# Altium schematic sheet 07-TCXO_Crystal.SchDoc
size B; SheetNumber: 7; SheetTotal: 12
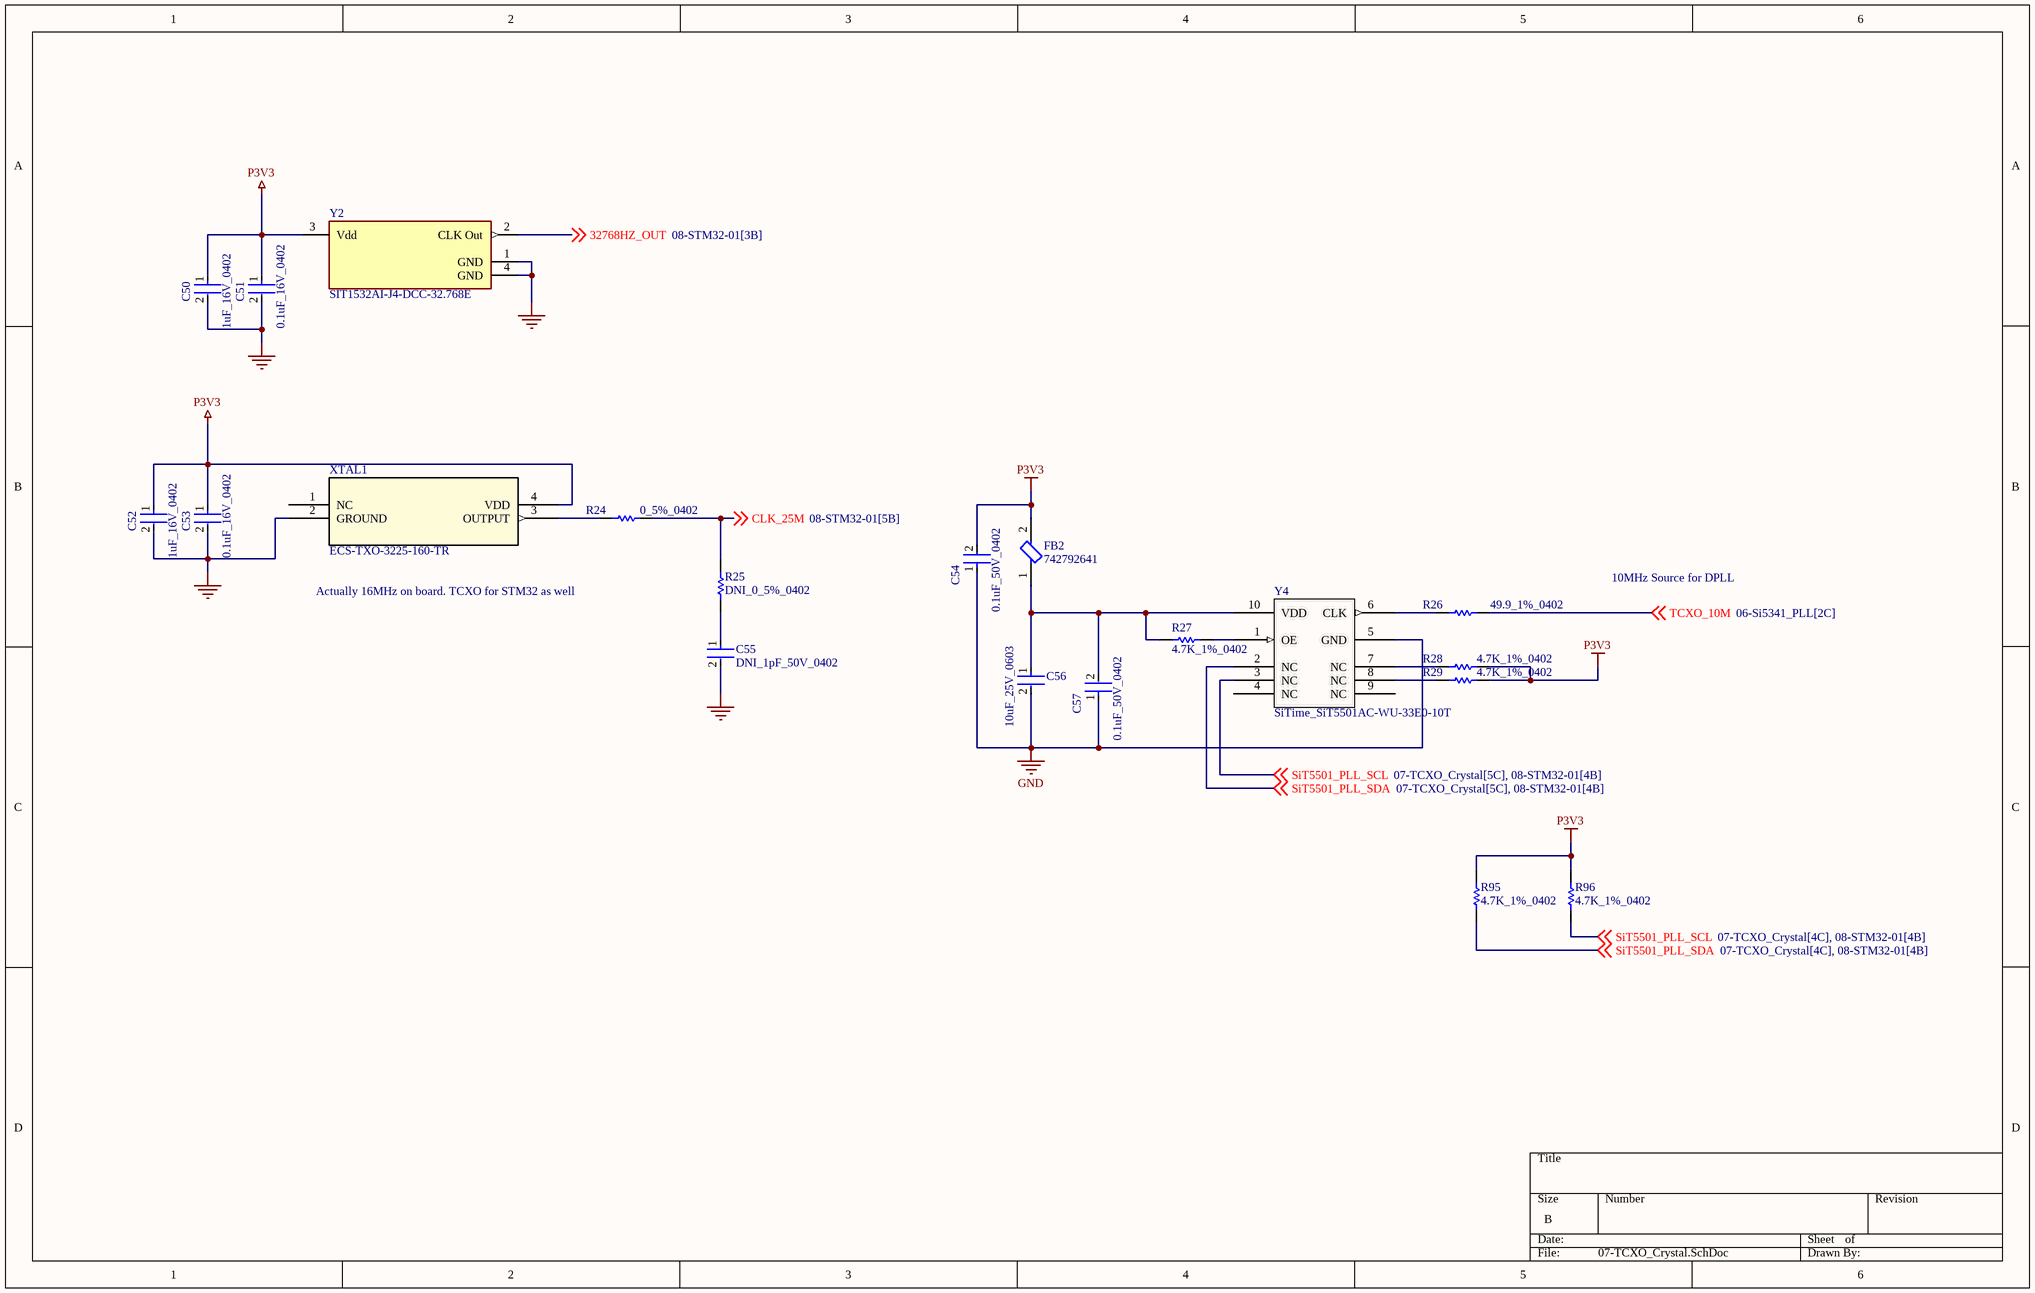
[diagram p0: 07-TCXO_Crystal.SchDoc]

## Parts
C50  1uF_16V_0402  [FP-0402-L_1_0_0_05-W_0_5-IPC_A]
C51  0.1uF_16V_0402  [FP-C0402-BB-MFG]
C52  1uF_16V_0402  [FP-0402-L_1_0_0_05-W_0_5-IPC_A]
C53  0.1uF_16V_0402  [FP-C0402-BB-MFG]
C54  0.1uF_50V_0402  [FP-C1005-050-0_05-IPC_C]
C55  DNI_1pF_50V_0402  [FP-GJM155-0_05-IPC_B]  (no BOM)
C56  10uF_25V_0603  [FP-CL10-IPC_C]
C57  0.1uF_50V_0402  [FP-C1005-050-0_05-IPC_C]
FB2  742792641  [FP-742792641-MFG]
R24  0_5%_0402  [RESC1005X40X25NL05T10]
R25  DNI_0_5%_0402  [RESC1005X40X25NL05T10]  (no BOM)
R26  49.9_1%_0402  [RESC1005X40X25NL10T10]
R27  4.7K_1%_0402  [RESC1005X40X25NL10T10]
R28  4.7K_1%_0402  [RESC1005X40X25NL10T10]
R29  4.7K_1%_0402  [RESC1005X40X25NL10T10]
R95  4.7K_1%_0402  [RESC1005X40X25NL10T10]
R96  4.7K_1%_0402  [RESC1005X40X25NL10T10]
XTAL1  ECS-TXO-3225-160-TR  [ECS-TXO-3225_ECS]
Y2  SIT1532AI-J4-DCC-32.768E  [FP-SIT1532-MFG]
Y4  SiTime_SiT5501AC-WU-33E0-10T  [SITIME_SPL-086-CQFN-010-C07050_REV_DRAFT]

## Nets
GND: C50.2 C51.2 C52.2 C53.2 C54.1 C55.2 C56.2 C57.1 XTAL1.2(GROUND) Y2.1(GND) Y2.4(GND) Y4.5(GND)
P3V3: C50.1 C51.1 C52.1 C53.1 C54.2 FB2.2 R28.2 R29.2 R95.2 R96.2 XTAL1.4(VDD) Y2.3(Vdd)
32768HZ_OUT: Y2.2(CLK_Out) ; off-sheet 32768HZ_OUT
CLK_25M: R24.2 R25.2 ; off-sheet CLK_25M
SiT5501_PLL_SCL: R96.1 Y4.3(NC) ; off-sheet SiT5501_PLL_SCL
SiT5501_PLL_SDA: R95.1 Y4.2(NC) ; off-sheet SiT5501_PLL_SDA
TCXO_10M: R26.1 ; off-sheet TCXO_10M
NetC55_1: C55.1 R25.1
NetC56_1: C56.1 C57.2 FB2.1 R27.1 Y4.10(VDD)
NetR24_1: R24.1 XTAL1.3(OUTPUT)
NetR26_2: R26.2 Y4.6(CLK)
NetR27_2: R27.2 Y4.1(OE)
NetR28_1: R28.1 Y4.7(NC)
NetR29_1: R29.1 Y4.8(NC)

Not connected (* = marked no-connect by the designer): XTAL1 1(NC); Y4 4(NC) 9(NC)

## Notes on the sheet
- Actually 16MHz on board. TCXO for STM32 as well
- 10MHz Source for DPLL

## Library data of the parts
C50 C52 = CMP-14477-000104-2: None; Tolerance: 10%; Voltage Rating: 16V; Dielectric: X5R; Capacitance: 1uF; Packaging: Tape and Reel; Depth: 0.5mm; Mount: Surface Mount; Thickness: 0.022inch; Package Quantity: 1; Min Operating Temperature: -55°C; Series: M; Voltage Rating (DC): 16V; Termination: SMD/SMT; Case/Package: 0402; Number of Pins: 2; Case Code (Imperial): 0402; Length: 1mm; Halogen Free: Halogen Free; Case Code (Metric): 1005; Width: 0.02inch; RoHS Compliant: Yes; Radiation Hardening: No; Max Operating Temperature: 85°C; Height: 0.5mm; Construction: Flat
C51 C53 = CMP-1034-02068-3: CAP CER 0.1UF 16V 5% X7R 0402; Manufacturer: Kemet; Manufacturer Part Number: C0402C104J4RACTU; Value: 0.10 μF; Temperature Coefficient: 15%; Tolerance: 0.05; Material: Ceramic; ComponentLink2URL: https://content.kemet.com/datasheets/KEM_C1002_X7R_SMD.pdf; Automotive: No; Device Class L2: Capacitors; Temperature: -55°C to +125°C; RoHS: TRUE; Voltage Rating: 16 V; ComponentLink2Description: Datasheet; Device Class L3: Ceramic Capacitors; Temperature Range Low: -55°C; Ipc Land Pattern Name: CAPC10050X50; Device Class L1: Passive Components; Temperature Range High: +125°C; Package: C0402-BB; Capacitance: 0.10 μF; Category: Cap; Mouser Description: CAP CER 0.1UF 16V X7R 0402; Height: 0.55mm; Digikey Description: CAP CER 0.1UF 16V 5% X7R 0402; Octopart: https://octopart.com/c0402c104j4ractu-kemet-12573893; Temperature Characteristic: X7R; Lead Free: Yes
C54 C57 = CMP-2000-05393-2: Multilayer Ceramic Capacitors 100nF ±10% 50V X7R SMD 0402; Voltage: 50V; Dielectric Material: Ceramic; Min Operating Temperature: -55°C; Depth: 0.5mm; Radiation Hardening: No; RoHS Compliant: Yes; Voltage Rating (DC): 50V; Lead Free: Lead Free; Resistor Type: Ceramic; Height: 0.5mm; Dielectric: X7R; Thickness: 0.022inch; Case/Package: 0402; Case Code (Metric): 1005; Termination: SMD/SMT; Capacitance: 100nF; Packaging: Tape and Reel; Max Operating Temperature: 125°C; Mount: Surface Mount; Package Quantity: 1; Width: 0.02inch; Weight: 2.3E-05oz; Voltage Rating: 50V; Tolerance: 10%; Construction: Flat; Case Code (Imperial): 0402; Length: 1mm; REACH SVHC: No SVHC; Series: C
C55 = CMP-2008-03808-2: Multi-Layer Ceramic Capacitor 1pF C0G  ±0.1pF 0402 Paper T/R; Temperature Coefficient: 30ppm/°C; Voltage Rating (DC): 50V; REACH SVHC: No SVHC; Packaging: Tape and Reel; Width: 0.02inch; Package Quantity: 10000; Min Operating Temperature: -55°C; Case Code (Imperial): 0402; Lead Pitch: 0.3mm; Capacitance: 1pF; Length: 1mm; Max Operating Temperature: 125°C; Depth: 0.5mm; Thickness: 0.022inch; Case Code (Metric): 1005; Lead Free: Lead Free; Voltage: 50V; Mount: Surface Mount; Number of Pins: 2; Termination: SMD/SMT; Radiation Hardening: No; Dielectric: C0G; Case/Package: 0402; Voltage Rating: 50V; Height: 0.5mm
C56 = CMP-13271-004224-1: Cap Ceramic 10uF 25V X5R ±20% Pad SMD 0603 +85°C T/R; Width: 0.031inch; Voltage Rating: 25V; Length: 0.063inch; Case Code (Metric): 1608; Dielectric: X5R; Termination: Wraparound; Capacitance: 10uF; Lead Free: Lead Free; Mount: Surface Mount; Package Quantity: 1; Case Code (Imperial): 0603; Thickness: 0.035inch; Packaging: Tape and Reel; Contact Plating: Tin; Min Operating Temperature: -55°C; Tolerance: 20%; Max Operating Temperature: 85°C; Case/Package: 0603
FB2 = CMP-0220-00171-2: FERRITE BEAD 300 OHM 0603 1LN; Inductance: 18nH; Max DC Current: 2A; Number of Lines: 1; Test Frequency: 100MHz; Impedance: 300R; DC Resistance (DCR): 150mR; Tolerance: 25%; Case Code (Metric): 1608; Core Material: Ferrite; Length: 1.6mm; Lead Free: Lead Free; Series: WE-CBF; Min Operating Temperature: -55°C; RoHS Compliant: Yes; Case/Package: SMD/SMT; Material: Ferrite; Max Operating Temperature: 125°C; Termination: SMD/SMT; Packaging: Tape and Reel; Weight: 0.000141oz; Case Code (Imperial): 0603; Width: 0.8mm; Mount: Surface Mount; Max Current Rating: 2A; Package Quantity: 1; Depth: 0.8mm; Current Rating: 2A; Height: 0.8mm
R24 R25 = CMP-2002-06457-1: Manufacturer: Panasonic; Part Number: ERJ-U020R00X
R26 = CMP-2002-04448-1: Part Number: RK73H1ETTP49R9F; Manufacturer: KOA Speer
R27-R29 R95 R96 = CMP-2002-05217-1: Manufacturer: Bourns; Part Number: CR0402-FX-4701GLF
XTAL1 = ECS-TXO-3225-122.8-TR: No Description Available; Mfr_Name: ECS International; RefDes: RefDes; Type: Type; Supplier 1: Newark; Supplier Part Number 1: 54AK5779
Y2 = CMP-25159-261190-1: MEMS OSC XO 32.7680KHZ LVCMOS; Max Supply Voltage: 3.63V; Current Rating: 1.35uA; Frequency Stability: 100ppm; Frequency: 32.768kHz; Max Supply Current: 1.4uA; Load Capacitance: 10pF; Max Duty Cycle: 52%; Min Supply Voltage: 1.5V; Length: 1.5mm; Max Operating Temperature: 85°C; Packaging: Tape and Reel; Termination: SMD/SMT; Min Operating Temperature: -40°C; RoHS Compliant: Yes; Width: 0.8mm; Package Quantity: 1000; Lead Free: Lead Free; Mount: Surface Mount; Height: 0.6mm; Series: SiT1532
Y4 = CMP-OSC-00029-2: OSC, MEMS, STRATUM 3E, 10.000MHZ, 10PPB STAB, LVCMOS, 3.3V, O/P EN, 7.0X5.0X2.2MM, CQFN-10; Manufacturer Part Number: SiT5501AI-WU033JH-10.000000; Manufacturer: SiTime; Frequency: 10 MHz; Voltage - Supply: 3.3 V; Type: OCXO; Category: Oscillators; Max Operating Temperature: 70°C; Min Operating Temperature: -20°C; Height: 2.20mm (max); Case/Package: 10 Lead QFN; Output: LVCMOS; Mounting Type: Surface Mount; Frequency Stability: ±10 ppb; RoHS: Yes